# Altium schematic sheet modulo_programador_schdoc.SchDoc: Modulo Programador
size 393 x 281 mm; CheckedBy: Santiago Millicay; Author: Diego Coll; DocumentNumber: 1; Revision: 0.0.0; SheetNumber: 1; SheetTotal: 1; Organization: Altium Limited; Address1: L3, 12a Rodborough Rd; Address2: Frenchs Forest; Address3: NSW; Address4: Australia 2086; SheetFormat: A3
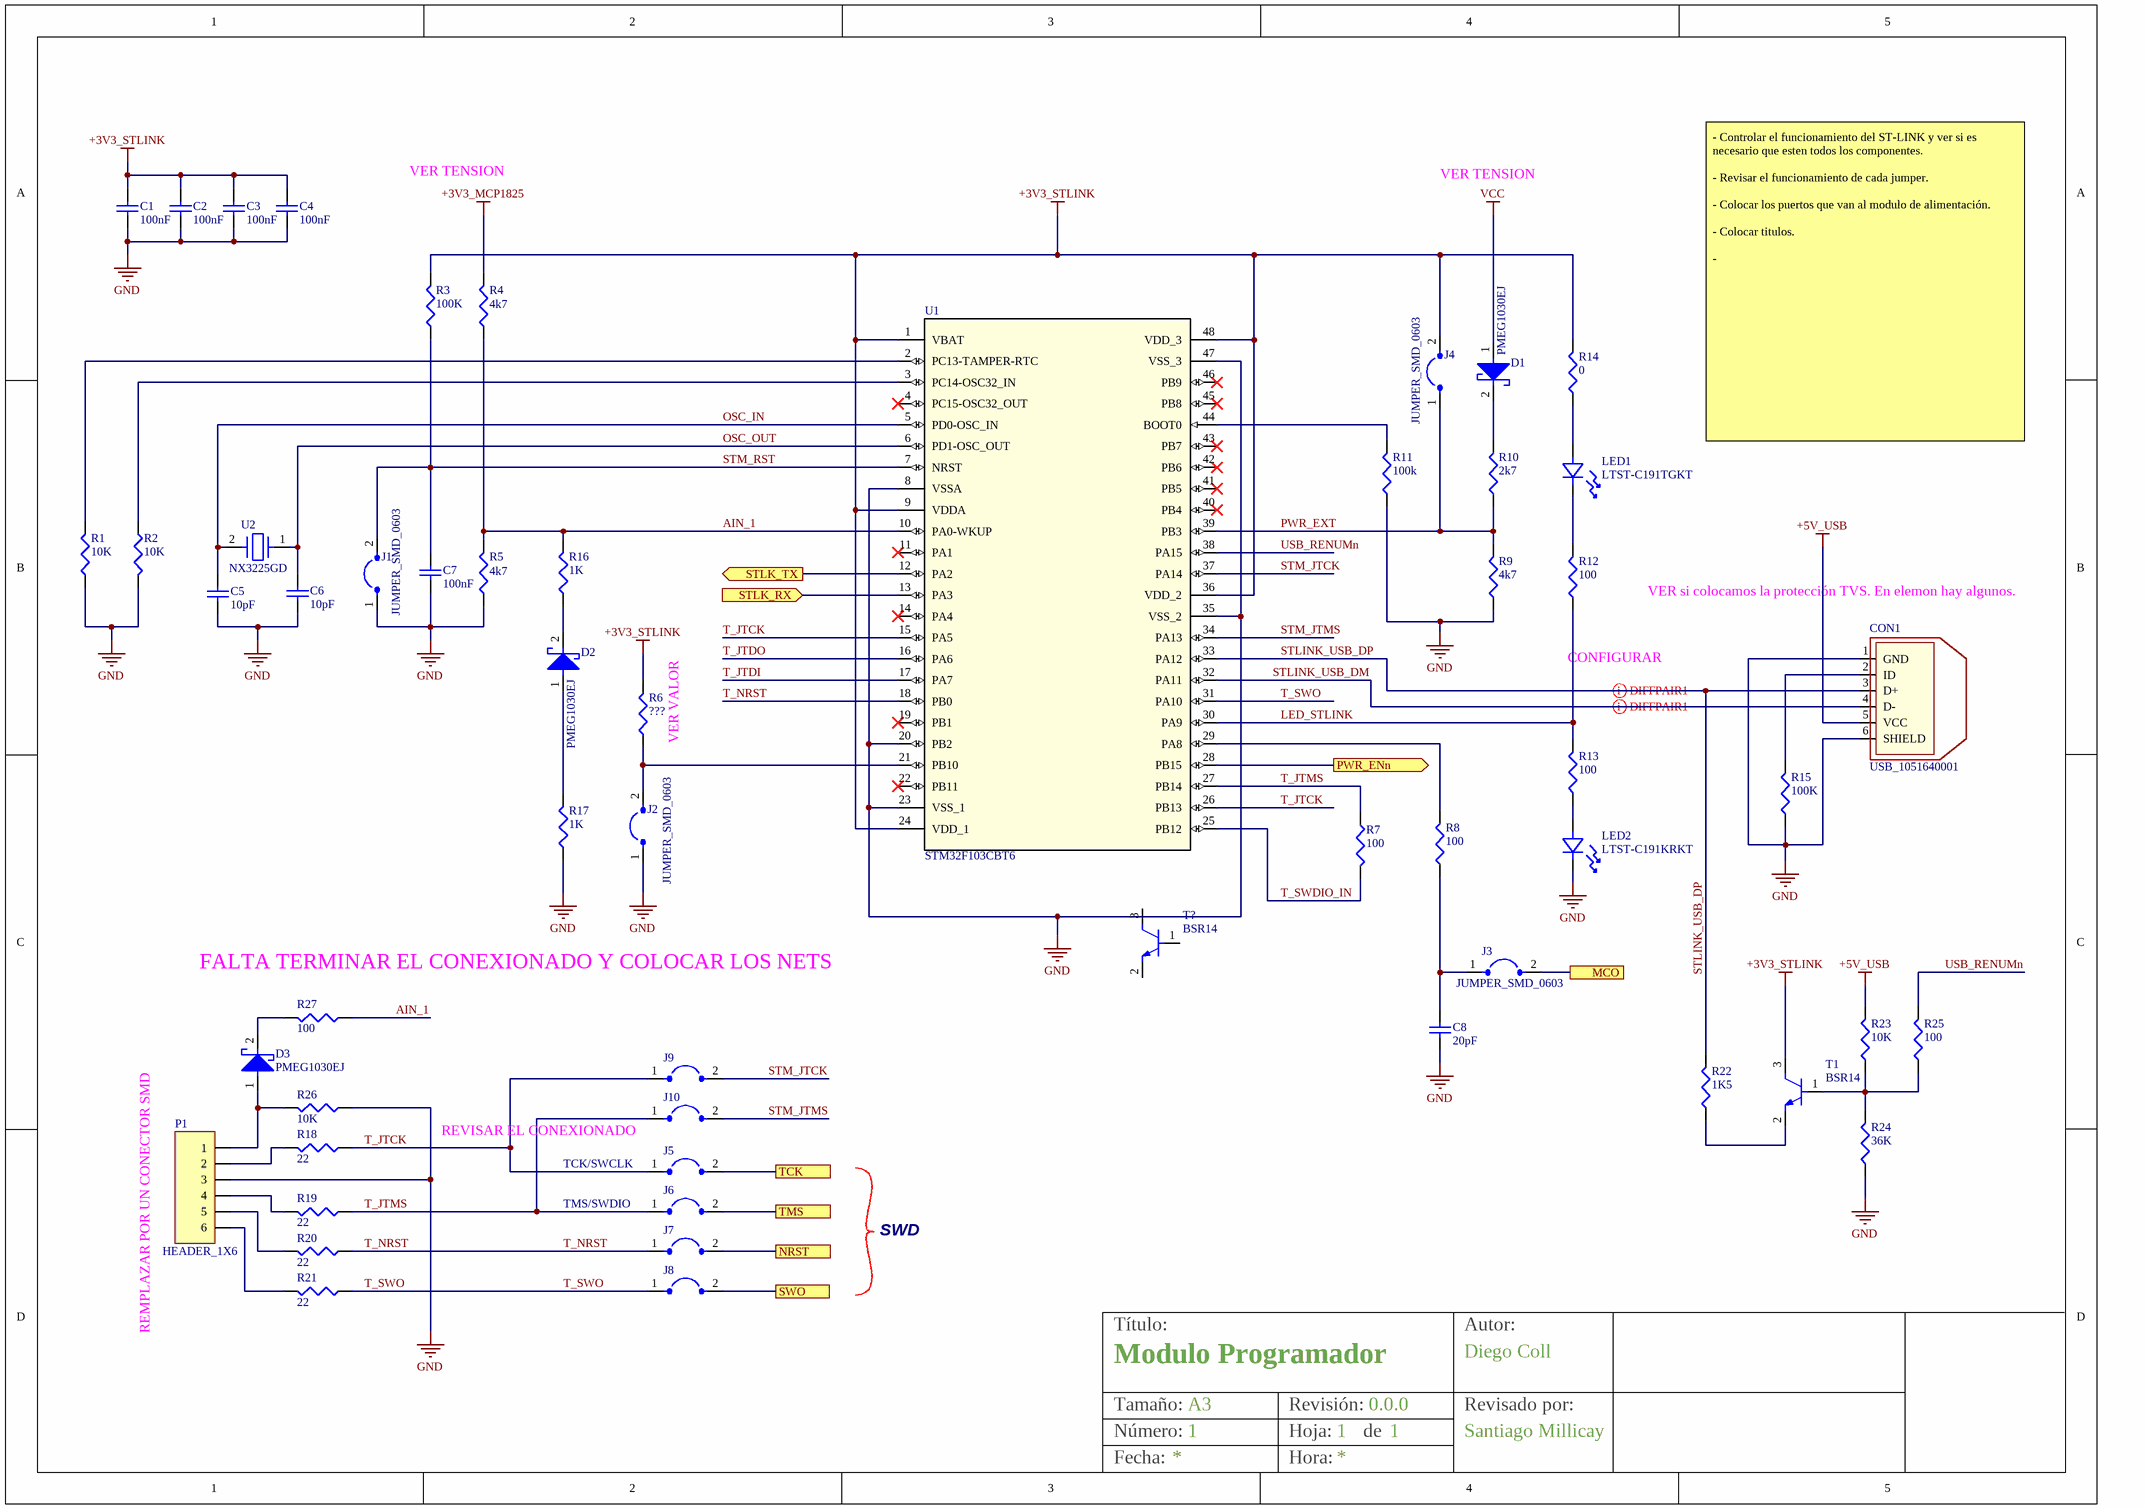
[diagram p0: modulo_programador_schdoc.SchDoc]

## Parts
C1  value 100nF  [1608[0603]]  (hidden comment: Cap Semi)
C2  value 100nF  [1608[0603]]  (hidden comment: Cap Semi)
C3  value 100nF  [1608[0603]]  (hidden comment: Cap Semi)
C4  value 100nF  [1608[0603]]  (hidden comment: Cap Semi)
C5  value 10pF  [1608[0603]]  (hidden comment: Cap Semi)
C6  value 10pF  [1608[0603]]  (hidden comment: Cap Semi)
C7  value 100nF  [1608[0603]]  (hidden comment: Cap Semi)
C8  value 20pF  [1608[0603]]  (hidden comment: Cap Semi)
CON1  USB_1051640001  [USB_1051640001]
D1  PMEG1030EJ  [PMEG1030EJ]
D2  PMEG1030EJ  [PMEG1030EJ]
D3  PMEG1030EJ  [PMEG1030EJ]
J1  JUMPER_SMD_0603  [JUMPER_SMD_0603]
J2  JUMPER_SMD_0603  [JUMPER_SMD_0603]
J3  JUMPER_SMD_0603  [JUMPER_SMD_0603]
J4  JUMPER_SMD_0603  [JUMPER_SMD_0603]
J5  JUMPER_SMD_0603  [JUMPER_SMD_0603]  (value not drawn)
J6  JUMPER_SMD_0603  [JUMPER_SMD_0603]  (value not drawn)
J7  JUMPER_SMD_0603  [JUMPER_SMD_0603]  (value not drawn)
J8  JUMPER_SMD_0603  [JUMPER_SMD_0603]  (value not drawn)
J9  JUMPER_SMD_0603  [JUMPER_SMD_0603]  (value not drawn)
J10  JUMPER_SMD_0603  [JUMPER_SMD_0603]  (value not drawn)
LED1  LTST-C191TGKT  [LTST-C191TGKT]
LED2  LTST-C191KRKT  [LTST-C191KRKT]
P1  HEADER_1X6  [HEADER_1X6]
R1  value 10K  [J1-0603]  (hidden comment: Res3)
R2  value 10K  [J1-0603]  (hidden comment: Res3)
R3  value 100K  [J1-0603]  (hidden comment: Res3)
R4  value 4k7  [J1-0603]  (hidden comment: Res3)
R5  value 4k7  [J1-0603]  (hidden comment: Res3)
R6  value ???  [J1-0603]  (hidden comment: Res3)
R7  value 100  [J1-0603]  (hidden comment: Res3)
R8  value 100  [J1-0603]  (hidden comment: Res3)
R9  value 4k7  [J1-0603]  (hidden comment: Res3)
R10  value 2k7  [J1-0603]  (hidden comment: Res3)
R11  value 100k  [J1-0603]  (hidden comment: Res3)
R12  value 100  [J1-0603]  (hidden comment: Res3)
R13  value 100  [J1-0603]  (hidden comment: Res3)
R14  value 0  [J1-0603]  (hidden comment: Res3)
R15  value 100K  [J1-0603]  (hidden comment: Res3)
R16  value 1K  [J1-0603]  (hidden comment: Res3)
R17  value 1K  [J1-0603]  (hidden comment: Res3)
R18  value 22  [J1-0603]  (hidden comment: Res3)
R19  value 22  [J1-0603]  (hidden comment: Res3)
R20  value 22  [J1-0603]  (hidden comment: Res3)
R21  value 22  [J1-0603]  (hidden comment: Res3)
R22  value 1K5  [J1-0603]  (hidden comment: Res3)
R23  value 10K  [J1-0603]  (hidden comment: Res3)
R24  value 36K  [J1-0603]  (hidden comment: Res3)
R25  value 100  [J1-0603]  (hidden comment: Res3)
R26  value 10K  [J1-0603]  (hidden comment: Res3)
R27  value 100  [J1-0603]  (hidden comment: Res3)
T1  BSR14  [BSR14]
T?  BSR14  [BSR14]
U1  STM32F103CBT6  [STM32F103CBT6]
U2  NX3225GD  [NX3225GD-8MHZ]

## Ports
MCO, NRST, PWR_ENn (out), STLK_RX (in), STLK_TX (out), SWO, TCK, TMS

## Nets
+3V3_MCP1825: R4.2
+3V3_STLINK: C1.2 C2.2 C3.2 C4.2 J4.2 R3.2 R6.2 R14.2 T1.3(C) U1.1(VBAT) U1.9(VDDA) U1.24(VDD_1) U1.36(VDD_2) U1.48(VDD_3)
+5V_USB: CON1.5(VCC) R23.2
GND: C1.1 C2.1 C3.1 C4.1 C5.1 C6.1 C7.1 C8.1 CON1.1(GND) CON1.6(SHIELD) J1.1 J2.1 LED2.2(K) P1.3 R1.1 R2.2 R5.1 R9.1 R11.1 R15.1 R17.1 R24.1 R26.1 U1.8(VSSA) U1.20(PB2) U1.23(VSS_1) U1.35(VSS_2) U1.47(VSS_3)
VCC: D1.1(A)
AIN_1: R4.1 R5.2 R16.2 R27.1 U1.10(PA0-WKUP)
LED_STLINK: R12.1 R13.2 U1.30(PA9)
MCO: J3.2 ; port MCO
NRST: J7.2 ; port NRST
OSC_IN: C5.2 U1.5(PD0-OSC_IN) U2.2
OSC_OUT: C6.2 U1.6(PD1-OSC_OUT) U2.1
PWR_ENn: U1.28(PB15) ; port PWR_ENn
PWR_EXT: J4.1 R9.2 R10.1 U1.39(PB3)
STLINK_USB_DM: CON1.4(D-) U1.32(PA11)
STLINK_USB_DP: CON1.3(D+) R22.2 U1.33(PA12)
STLK_RX: U1.13(PA3) ; port STLK_RX
STLK_TX: U1.12(PA2) ; port STLK_TX
STM_JTCK: J9.2 U1.37(PA14)
STM_JTMS: J10.2 U1.34(PA13)
STM_RST: C7.2 J1.2 R3.1 U1.7(NRST)
SWO: J8.2 ; port SWO
T_JTCK: J5.1 J9.1 R18.1 U1.15(PA5) U1.26(PB13)
T_JTDI: U1.17(PA7)
T_JTDO: U1.16(PA6)
T_JTMS: J6.1 J10.1 R7.1 R19.1 U1.27(PB14)
T_NRST: J7.1 R20.1 U1.18(PB0)
T_SWDIO_IN: R7.2 U1.25(PB12)
T_SWO: J8.1 R21.1 U1.31(PA10)
TCK: J5.2 ; port TCK
TMS: J6.2 ; port TMS
USB_RENUMn: R25.2 U1.38(PA15)
NetC8_2: C8.2 J3.1 R8.1
NetCON1_2: CON1.2(ID) R15.2
NetD1_2: D1.2(K) R10.2
NetD2_1: D2.1(A) R17.2
NetD2_2: D2.2(K) R16.1
NetD3_1: D3.1(A) P1.1 R26.2
NetD3_2: D3.2(K) R27.2
NetJ2_2: J2.2 R6.1 U1.21(PB10)
NetLED1_1: LED1.1(A) R14.1
NetLED1_2: LED1.2(K) R12.2
NetLED2_1: LED2.1(A) R13.1
NetP1_2: P1.2 R18.2
NetP1_4: P1.4 R19.2
NetP1_5: P1.5 R20.2
NetP1_6: P1.6 R21.2
NetR1_2: R1.2 U1.2(PC13-TAMPER-RTC)
NetR2_1: R2.1 U1.3(PC14-OSC32_IN)
NetR8_2: R8.2 U1.29(PA8)
NetR11_2: R11.2 U1.44(BOOT0)
NetR22_1: R22.1 T1.2(E)
NetR23_1: R23.1 R24.2 R25.1 T1.1(B)

Not connected (* = marked no-connect by the designer): T? 1(B) 2(E) 3(C); U1 4(PC15-OSC32_OUT)* 11(PA1)* 14(PA4)* 19(PB1)* 22(PB11)* 40(PB4)* 41(PB5)* 42(PB6)* 43(PB7)* 45(PB8)* 46(PB9)*

## Layout directives
differential pair: STLINK_USB_DM, STLINK_USB_DP

## Notes on the sheet
- VER TENSION
- - Controlar el funcionamiento del ST-LINK y ver si es necesario que esten todos los componentes.
  - Revisar el funcionamiento de cada jumper.
  - Colocar los puertos que van al modulo de alimentación.
  - Colocar titulos.
  -
- VER si colocamos la protección TVS. En elemon hay algunos.
- (near R12) CONFIGURAR
- (near R6) VER VALOR
- (near R27) FALTA TERMINAR EL CONEXIONADO Y COLOCAR LOS NETS
- REVISAR EL CONEXIONADO
- TCK/SWCLK
- TMS/SWDIO
- SWD
- REMPLAZAR POR UN CONECTOR SMD
- Título:
- Autor:
- Tamaño:
- Número:
- Fecha:
- Revisión:
- Hoja:
- Hora:
- de
- Revisado por:

## Library data of the parts
C1-C8 = Cap Semi: Capacitor (Semiconductor SIM Model); Published: 8-Jun-2000; LatestRevisionDate: 29-May-2009; LatestRevisionNote: IPC-7351 Footprint Added.; PackageReference: C1206; Publisher: Altium Limited; PackageDescription: Chip Capacitor
CON1 = USB_1051640001: USB MICRO; Manufacturer: Molex; Manufacturer Part Number: 105164-0001; Current Rating: 1.8A; Gender: Receptacle; Mating Cycles: 10000; Max Voltage Rating (AC): 30V; Number of Circuits: 5; Number of Ports: 1; Pitch: 0.65mm; Plating: Tin; Shielding: Shielded; USB Standard: USB 2.0; Supplier 1: Digi-Key; Category: USB Connectors; Color: Black; Connector Type: USB; Contact Material: Copper Alloy; Contact Plating: Gold; Depth: 5.15mm; Flammability Rating: UL94 V-0; Halogen Free: Low Halogen; Housing Material: Polymer; Insulation Color: Black; Length: 7.5mm; Max Operating Temperature: 85°C; Min Operating Temperature: -35°C; Mount: Surface Mount,Through Hole,Horizontal; Number of Contacts: 5; Number of Terminals: 5; Orientation: Right Angle; Package Quantity: 6500; Packaging: Tape and Reel; Radiation Hardening: No; REACH SVHC: No SVHC; Termination: Solder; Voltage Rating (AC): 30V
D1-D3 = PMEG1030EJ: DIODO SCHOTTKY; Manufacturer: Nexperia; Manufacturer Part Number: PMEG1030EJ,115
LED1 = LTST-C191TGKT: DIODO LED VERDE; Manufacturer: Vishay Lite-On; Color: Green; Dominant Wavelength: 530nm; Forward Current: 25mA; Forward Voltage: 3.2V; Lens Color: Colorless; Lens Style: Clear,Diffused,Colorless,Rectangular; Lens Transparency: Clear; Luminous Intensity: 450mcd; Number of Elements: 1; Power Dissipation: 76mW; Reverse Voltage: 5V; Test Current: 20mA; Viewing Angle: 130°; Case Code (Imperial): 0603; Case Code (Metric): 1608; Case/Package: 0603; Category: LEDs; Depth: 0.8mm; Height: 0.55mm; Illumination Color: Green; Lead Free: Lead Free; Length: 1.6mm; Manufacturer Part Number: LTST-C191TGKT; Max Operating Temperature: 80°C; Min Operating Temperature: -20°C; Mount: Surface Mount; Number of LEDs: 1; Number of Pins: 2; Package Quantity: 1; Packaging: Tape and Reel; Radiation Hardening: No; Wavelength: 530nm; Width: 0.8mm
LED2 = LTST-C191KRKT: DIODO LED ROJO; Manufacturer: Vishay Lite-On; Color: Red; Dominant Wavelength: 631nm; Forward Current: 30mA; Forward Voltage: 2V; Lens Color: Colorless; Lens Style: Clear,Diffused,Colorless,Rectangular; Lens Transparency: Clear; Luminous Intensity: 54mcd; Number of Elements: 1; Power Dissipation: 75mW; Reverse Voltage: 5V; Test Current: 20mA; Viewing Angle: 130°; Wavelength: 639nm; Case Code (Imperial): 0603; Case Code (Metric): 1608; Case/Package: 0603; Category: LEDs; Depth: 0.8mm; Height: 0.55mm; Illumination Color: Red; Lead Free: Lead Free; Length: 1.6mm; Manufacturer Part Number: LTST-C191KRKT; Max Operating Temperature: 85°C; Min Operating Temperature: -55°C; Mount: Surface Mount; Number of LEDs: 1; Number of Pins: 2; Package Quantity: 1; Packaging: Tape and Reel; Power Rating: 75mW; Radiation Hardening: No; Voltage: 2V; Width: 0.8mm
P1 = HEADER_1X6: Header, 6-Pin; LatestRevisionDate: 17-Jul-2002; LatestRevisionNote: Re-released for DXP Platform.; Publisher: Altium Limited
R1-R27 = Res3: Resistor; Published: 8-Jun-2000; LatestRevisionDate: 29-May-2009; LatestRevisionNote: IPC-7351 Footprint Added.; PackageReference: J1-0603; Publisher: Altium Limited; PackageDescription: Chip Resistor
T1 T? = BSR14: Transistor NPN 40V 0.8A SOT23; Manufacturer: Philips; Current Rating: 800mA; Power Dissipation: 350mW; Case/Package: SOT-23; Category: BJTs; Collector Emitter Breakdown Voltage: 40V; Lead Free: Lead Free; Manufacturer Part Number: BSR14; Number of Pins: 3; Packaging: Cut Tape; Polarity: NPN; REACH SVHC: No SVHC; Voltage Rating (DC): 40V
U1 = STM32F103CBT6: Manufacturer: STMicroelectronics; Address Bus Width: 32b; Core Architecture: ARM; Density: 128KB; Frequency: 72MHz; Interface: I2C,SPI,USB,CAN,IrDA,UART,USART,LIN; Max Power Dissipation: 363mW; Max Supply Voltage: 3.6V; Memory Type: FLASH; Min Supply Voltage: 2V; Number of ADC Channels: 10; Number of Bits: 32; Number of I/Os: 37; Number of I2C Channels: 2; Number of PWM Channels: 12; Number of Timers/Counters: 4; Oscillator Type: Internal; Peripherals: POR,PWM,WDT,DMA,Temp Sensor,I2C; RAM Size: 20KB; Watchdog Timer: Yes; Case/Package: LQFP; Category: Microcontrollers; Contact Plating: Gold; Data Bus Width: 32b; Height: 1.45mm; Lead Free: Lead Free; Length: 7mm; Manufacturer Part Number: STM32F103CBT6; Max Frequency: 72MHz; Max Operating Temperature: 85°C; Memory Size: 128KB; Min Operating Temperature: -40°C; Number of Pins: 48; Number of Programmable I/O: 37; Number of SPI Channels: 2; Package Quantity: 250; Packaging: Tray; Radiation Hardening: No; REACH SVHC: No SVHC; Termination: SMD/SMT; Width: 7.2mm
U2 = NX3225GD-8MHZ: CRISTAL 8MHZ SMD; Manufacturer: NDK; Manufacturer Part Number: NX3225GD-8MHZ-STD-CRA-3; ESR (Equivalent Series Resistance): 500R; Frequency Stability: 150ppm; Frequency Tolerance: 50ppm; Load Capacitance: 8pF; Case/Package: SMD/SMT; Category: Crystals; Frequency: 8MHz; Height: 0.039inch; Length: 0.126inch; Max Operating Temperature: 150°C; Min Operating Temperature: -40°C; Mount: Surface Mount; Number of Pins: 2; Package Quantity: 3000; Packaging: Tape and Reel; Width: 0.098inch